# Altium project USB_SERIAL.PrjPcb
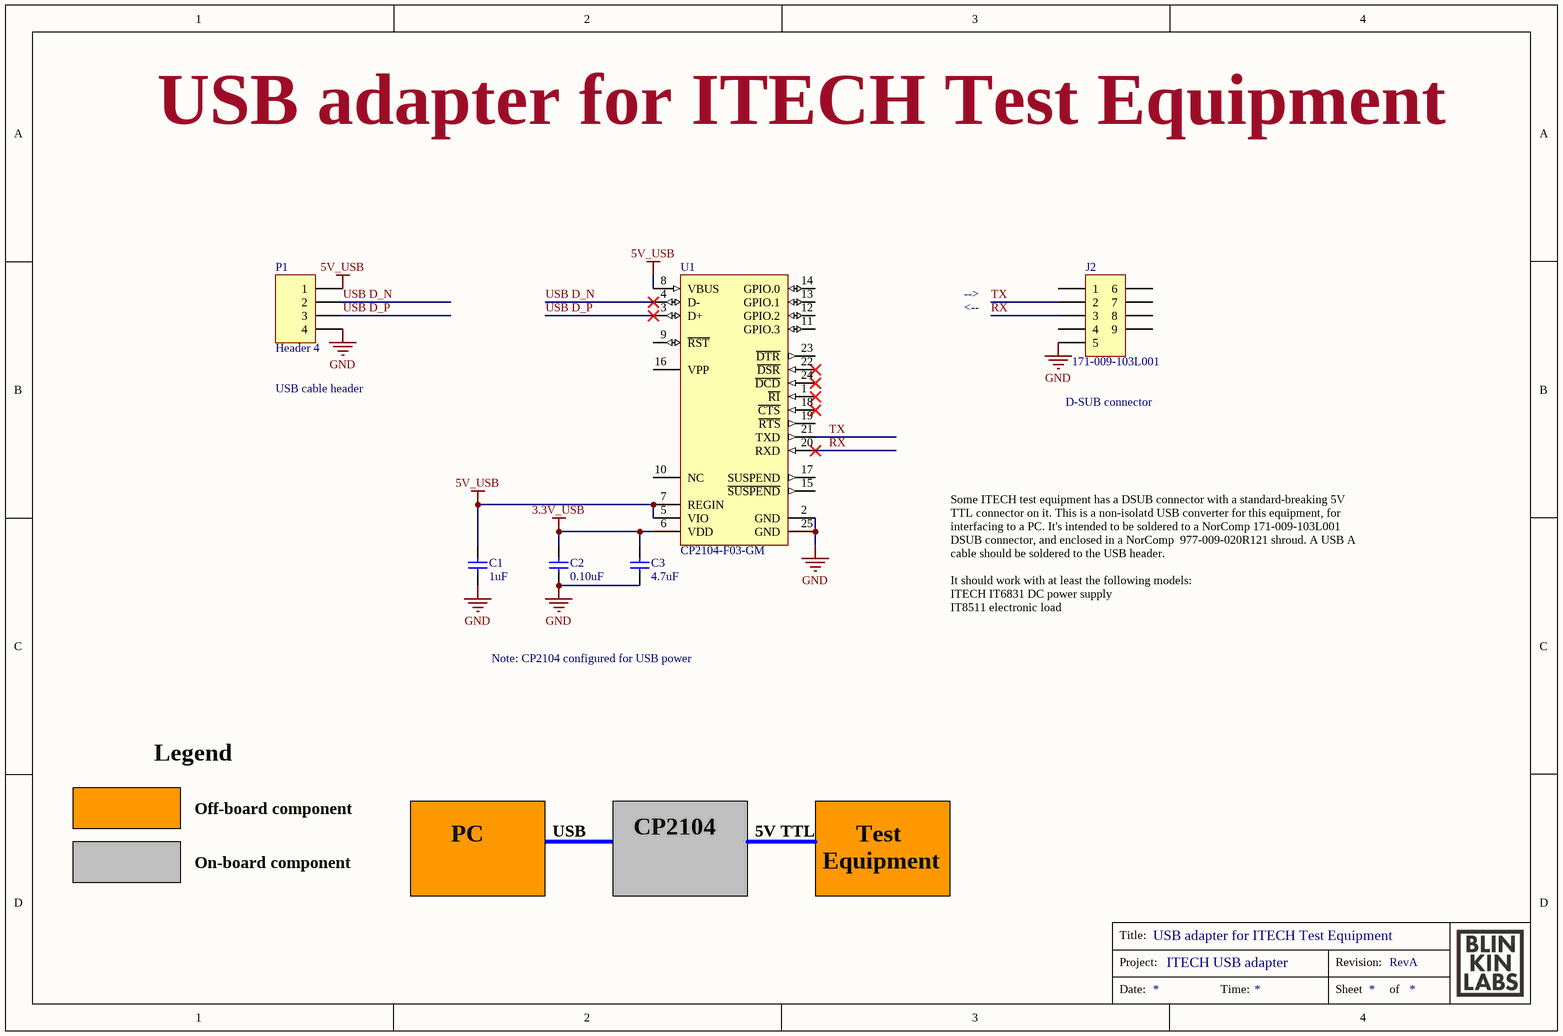
[diagram p0: Sheet1.SchDoc]
VersionRevision: RevA; Project: ITECH USB adapter
1 sheet, 6 parts. Net scope: global (net labels, ports and power ports of the same name join across sheets).
Board file: PCB1.PcbDoc

## Sheet Sheet1.SchDoc: USB adapter for ITECH Test Equipment
size A4; Organization: Blinkinlabs, LLC

### Parts
C1  1uF  [CAPC1005X06L]
C2  0.10uF  [CAPC1005X06L]
C3  4.7uF  [CAPC1005X06L]
J2  171-009-103L001  [171-009-103L001]
P1  Header 4  [HDR1X4]
U1  CP2104-F03-GM  [SLAB-QFN-24-2675x2675TP_M]

### Nets
3.3V_USB: C2.2 C3.1 U1.6(VDD)
5V_USB: C1.1 P1.1 U1.5(VIO) U1.7(REGIN) U1.8(VBUS)
GND: C1.2 C2.1 C3.2 J2.5 P1.4 U1.2(GND) U1.25(GND)
RX: J2.3 U1.20(RXD)
TX: J2.2 U1.21(TXD)
USB D_N: P1.2 U1.4(D-)
USB D_P: P1.3 U1.3(D+)

Not connected (* = marked no-connect by the designer): J2 1 4 6 7 8 9; U1 1(~{RI})* 9(~{RST}) 10(NC) 11(GPIO.3) 12(GPIO.2) 13(GPIO.1) 14(GPIO.0) 15(~{SUSPEND}) 16(VPP) 17(SUSPEND) 18(~{CTS})* 19(~{RTS}) 22(~{DSR})* 23(~{DTR}) 24(~{DCD})*

### Notes on the sheet
- <--
- -->
- USB cable header
- D-SUB connector
- Some ITECH test equipment has a DSUB connector with a standard-breaking 5V TTL connector on it. This is a non-isolatd USB converter for this equipment, for interfacing to a PC. It's intended to be soldered to a NorComp 171-009-103L001 DSUB connector, and enclosed in a NorComp  977-009-020R121 shroud. A USB A cable should be soldered to the USB header.
  It should work with at least the following models:
  ITECH IT6831 DC power supply
  IT8511 electronic load
- Note: CP2104 configured for USB power
- Legend
- Off-board component
- PC
- USB
- CP2104
- 5V TTL
- Test
- On-board component
- Equipment
- Title:
- Project:
- Revision:
- Date:
- Time:
- Sheet
- of

### Library data of the parts
C1 = GRM155R61A105KE15D: CAP CER 1UF 10V X5R 0402; Manufacturer: Murata Electronics North America; Tolerance: ±10%; PartNumber: GRM155R61A105KE15D; Datasheets: http://www.murata.com/~/media/webrenewal/support/library/catalog/products/capacitor/mlcc/c02e.pdf; Image: //media.digikey.com/Renders/Murata%20Renders/ZRB-SERIES-0402.jpg; Digi-Key Part Number: 490-3890-1-ND; Packaging: Cut Tape (CT); Series: GRM; Value: 1uF; Voltage: 10V; Temperature Coefficient: X5R; Operating Temperature: -55°C ~ 85°C; Features: -; Applications: General Purpose; Package / Case: 0402 (1005 Metric); Case/Package: 0402
C2 = GRM152R61A104ME19D: CAP CER 0.1UF 10V X5R 0402; Manufacturer: Murata Electronics North America; Tolerance: ±20%; Datasheets: http://www.murata.com/~/media/webrenewal/support/library/catalog/products/capacitor/mlcc/c02e.pdf; Image: //media.digikey.com/Renders/Murata%20Renders/ZRB-SERIES-0402.jpg; Digi-Key Part Number: 490-10009-1-ND; Packaging: Cut Tape (CT); Series: GRM; Value: 0.10uF; Voltage: 10V; Temperature Coefficient: X5R; Operating Temperature: -55°C ~ 85°C; Features: Derating Recommended; Applications: General Purpose; Package / Case: 0402 (1005 Metric); Case/Package: 0402; PartNumber: GRM152R61A104ME19D
C3 = GRM155R60J475ME47D: CAP CER 4.7UF 6.3V X5R 0402; Manufacturer: Murata Electronics North America; Tolerance: ±20%; PartNumber: GRM155R60J475ME47D; Datasheets: http://www.murata.com/~/media/webrenewal/support/library/catalog/products/capacitor/mlcc/c02e.pdf; Image: //media.digikey.com/Renders/Murata%20Renders/ZRB-SERIES-0402.jpg; Digi-Key Part Number: 490-5915-1-ND; Packaging: Cut Tape (CT); Series: GRM; Value: 4.7uF; Voltage: 6.3V; Temperature Coefficient: X5R; Operating Temperature: -55°C ~ 85°C; Features: Derating Recommended; Applications: General Purpose; Package / Case: 0402 (1005 Metric); Case/Package: 0402
J2 = 171-009-103L001: CONN D-SUB PLUG 9POS PNL MNT, side mount DSUB connector; Manufacturer: NorComp Inc.; PartNumber: 171-009-103L001; Digikey PartNumber: 209ME-ND
P1 = Header 4: Header, 4-Pin; LatestRevisionDate: 17-Jul-2002; LatestRevisionNote: Re-released for DXP Platform.; Publisher: Altium Limited
U1 = CMP-0511-00004-1: Single-Chip USB to UART Bridge, 4 Dig I/O Pins, Internal Oscillator, 1024 Bytes EEPROM, -40 to 85 degC, 24-pin QFN; Manufacturer: Silicon Labs; Sub-Family: USB Bridges; Internal Oscillator: TRUE; Mounting Technology: Surface Mount; ComponentLink3URL: http://www.silabs.com/Support%20Documents/TechnicalDocs/C8051F93x-92x.pdf; DatasheetVersion: Rev. 1.0; ComponentLink1URL: http://www.silabs.com/; Code_IPC: J-STD-020; ComponentLink2URL: http://www.silabs.com/Support%20Documents/TechnicalDocs/cp2104.pdf; Code_JEDEC: MO-220; PackageReference: QFN-24; ComponentLink3Description: Package Specification; PartNumber: CP2104-F03-GM; ComponentLink1Description: Manufacturer URL; ComponentLink2Description: Datasheet; EEPROM: 1024 Bytes; PackageDescription: 24-Pin Quad-Flat No-Leads Package, Body 4 x 4 mm, Pitch 0.5 mm